# Altium schematic sheet 峰值检波.SchDoc
size A4
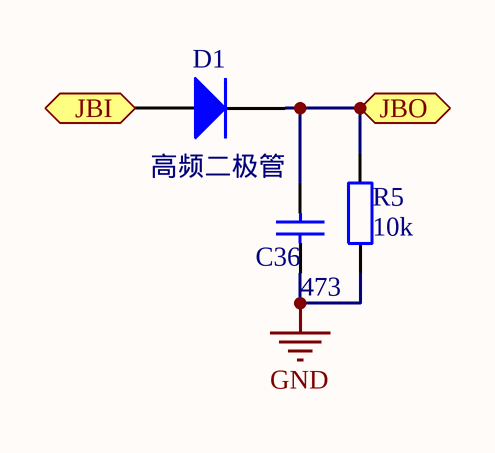
[diagram p0: 峰值检波.SchDoc]

## Parts
C36  瓷片电容  [瓷片电容]  (value not drawn)
D1  高频二极管  [DO-41]
R5  value 10k  [AXIAL-0.4]  (hidden comment: Res2)

## Ports
JBI (out), JBO (out)

## Nets
GND: C36.1 R5.1
JBI: D1.1(A) ; port JBI
JBO: C36.2 D1.2(K) R5.2 ; port JBO

## Notes on the sheet
- 标题
- 日期
- 红外数字模拟接收一体机
- 2015 5 29
- 作者
- 模电组
- 单位
- 电子技术协会
- (in symbol 瓷片电容) 473

## Library data of the parts
D1 = Diode 1N4007: 1 Amp General Purpose Rectifier; Published: 8-Jun-2000; LatestRevisionDate: 17-Jul-2002; LatestRevisionNote: Re-released for DXP Platform.; DatasheetDocument: 1998; PackageDocument: Aug-1999; PackageReference: DO-41; Publisher: Altium Limited; Code_JEDEC: DO-204-AL; ComponentLink1Description: Manufacturer Link; ComponentLink1URL: http://www.fairchildsemi.com/; ComponentLink2Description: Datasheet; ComponentLink2URL: http://www.fairchildsemi.com/ds/1N%2F1N4001.pdf
R5 = Res2: Resistor; Published: 8-Jun-2000; LatestRevisionDate: 17-Jul-2002; LatestRevisionNote: Re-released for DXP Platform.; PackageReference: AXIAL-0.4; Publisher: Altium Limited